# EasyEDA Pro project rpi pico w adapter.epro

# Board PCB1
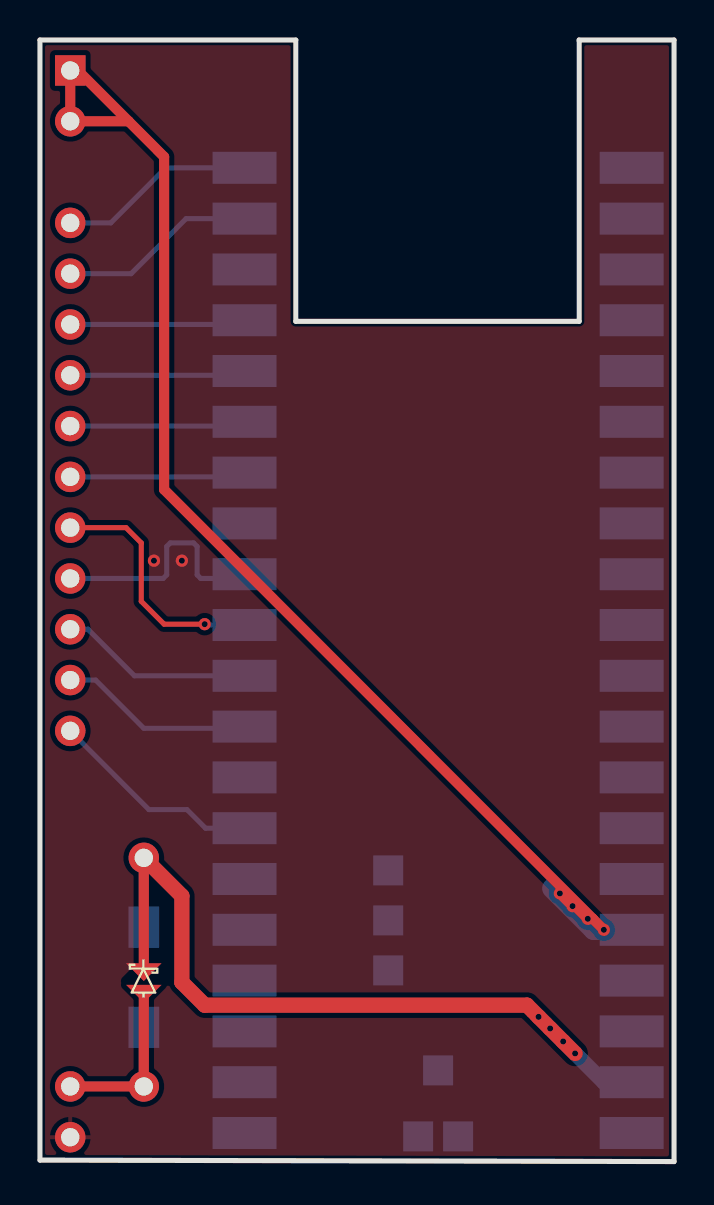
[diagram p0: board, top side]
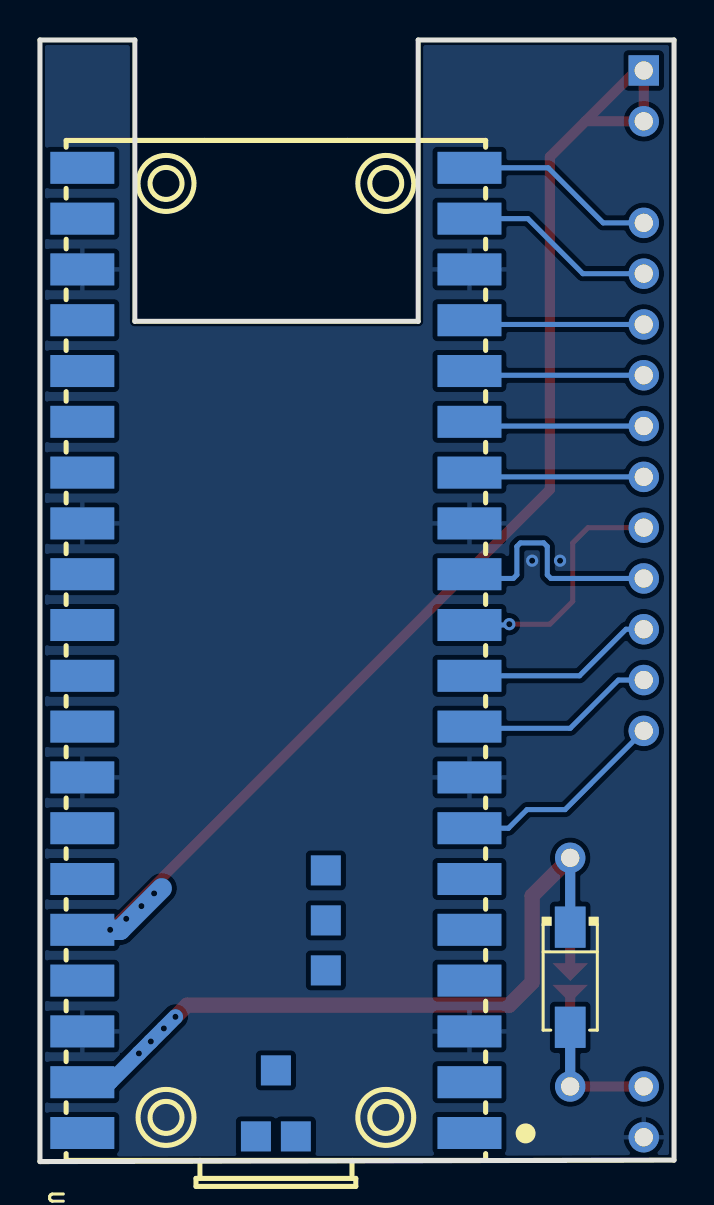
[diagram p1: board, bottom side, seen from below]

Outline 31.74 x 56.08 mm; copper layers: Top Layer, Bottom Layer. Coordinates in mm from the lower left corner of the outline.
Outline path: 0,56.08 0,0.07 31.74,0 31.74,56.08 26.99,56.08 26.99,42.01 12.81,42.01 12.81,56.08 0,56.08
Stack: Top Layer 0.035mm / Dielectric1 1.51mm FR4 er 4.5 / Bottom Layer 0.035mm

## Design rules (mm)
template: JLCPCB Capability(Two Layers Board)
spacing copperThickness1oz (default): track to track 0.102, other pairs 0.152 to 0.3
spacing copperThickness2oz: track to track 0.203, other pairs 0.152 to 0.3
track width copperThickness1oz (default): min 0.127, default 0.254, max 2.54
track width copperThickness2oz: min 0.203, default 0.254, max 2.54
differential pair differentialPair (default): width min 0.127, default 0.254, max 2.54; gap min 0.152, default 0.152
via viaSize (default): diameter min 0.5, default 0.61, max 10; hole min 0.3, default 0.305, max 6.3

## Placement (name value [footprint] x y rotation side)
NOREF  -  [Pad_e25]  1.52 24.08 0 top
NOREF#2  -  [Pad_e24]  1.52 21.54 0 top
NOREF#3  -  [Pad_e33]  1.52 36.78 0 top
NOREF#4  -  [Pad_e23]  1.52 3.76 0 top
NOREF#5  -  [Pad_e38]  1.52 52.02 0 top
NOREF#6  -  [Pad_e26]  1.52 26.62 0 top
NOREF#7  -  [Pad_e120]  5.2 9.47 180 top
NOREF#8  -  [Pad_e32]  1.52 34.24 0 top
NOREF#9  -  [Pad_e118]  5.2 8.39 0 top
NOREF#10  -  [Pad_e27]  1.52 29.16 0 top
NOREF#11  -  [Pad_e34]  1.52 39.32 0 top
NOREF#12  -  [Pad_e41]  5.2 3.76 0 top
NOREF#13  -  [Pad_e36]  1.52 44.4 0 top
NOREF#14  -  [Pad_e37]  1.52 46.94 0 top
NOREF#15  -  [Pad_e39]  1.52 54.56 0 top
NOREF#16  -  [Pad_e40]  5.2 15.19 0 top
NOREF#17  -  [Pad_e28]  1.52 31.7 0 top
NOREF#18  -  [Pad_e22]  1.52 1.22 0 top
NOREF#19  -  [Pad_e35]  1.52 41.86 0 top
schottky  SS54  [SMA_L4.4-W2.8-LS5.4-R-RD]  5.2 9.22 270 bottom
U5  PICO W  [COMM-SMD_L51.0-W21.0-P2.54_PICOW]  19.93 25.47 90 bottom

## Footprints (pads in the part's own frame, mm; a bottom-side part is the same pattern mirrored in y, then rotated)
COMM-SMD_L51.0-W21.0-P2.54_PICOW
  rect 1.6x3.2 smd: 1(-24.045,-9.69) 2(-21.505,-9.69) 3(-18.965,-9.69) 4(-16.425,-9.69) 5(-13.885,-9.69) 6(-11.345,-9.69) 7(-8.805,-9.69) 8(-6.265,-9.69) 9(-3.725,-9.69) 10(-1.185,-9.69) 11(1.355,-9.69) 12(3.895,-9.69) 13(6.435,-9.69) 14(8.975,-9.69) 15(11.515,-9.69) 16(14.055,-9.69) 17(16.595,-9.69) 18(19.135,-9.69) 19(21.675,-9.69) 20(24.215,-9.69) 21(24.215,9.69) 22(21.675,9.69) 23(19.135,9.69) 24(16.595,9.69) 25(14.055,9.69) 26(11.515,9.69) 27(8.975,9.69) 28(6.435,9.69) 29(3.895,9.69) 30(1.355,9.69) 31(-1.185,9.69) 32(-3.725,9.69) 33(-6.265,9.69) 34(-8.805,9.69) 35(-11.345,9.69) 36(-13.885,9.69) 37(-16.425,9.69) 38(-18.965,9.69) 39(-21.505,9.69) 40(-24.045,9.69)
  rect 1.5x1.5 smd: TP1(-20.915,0) TP2(-24.215,1) TP3(-24.215,-1) TP4(-15.915,-2.499) TP5(-13.415,-2.499) TP6(-10.915,-2.499)
Pad_e22
  round 1.524 hole 0.914: 1(0,0)
Pad_e23
  round 1.524 hole 0.914: 1(0,0)
Pad_e24
  round 1.524 hole 0.914: 1(0,0)
Pad_e25
  round 1.524 hole 0.914: 1(0,0)
Pad_e26
  round 1.524 hole 0.914: 1(0,0)
Pad_e27
  round 1.524 hole 0.914: 1(0,0)
Pad_e28
  round 1.524 hole 0.914: 1(0,0)
Pad_e32
  round 1.524 hole 0.914: 1(0,0)
Pad_e33
  round 1.524 hole 0.914: 1(0,0)
Pad_e34
  round 1.524 hole 0.914: 1(0,0)
Pad_e35
  round 1.524 hole 0.914: 1(0,0)
Pad_e36
  round 1.524 hole 0.914: 1(0,0)
Pad_e37
  round 1.524 hole 0.914: 1(0,0)
Pad_e38
  round 1.524 hole 0.914: 1(0,0)
Pad_e39
  rect 1.524x1.524 hole 0.914: 1(0,0)
Pad_e40
  round 1.524 hole 0.914: 1(0,0)
Pad_e41
  round 1.524 hole 0.914: 2(0,0)
Pad_e118
  custom 1.778x0.889 smd: 3(0,0)
Pad_e120
  custom 1.778x0.889 smd: 3(0,0)
SMA_L4.4-W2.8-LS5.4-R-RD
  rect 2.062x1.539 smd: 1(2.503,0) 2(-2.503,0)

## Nets
+3V3: NOREF#5.1 NOREF#15.1 U5.36
+5V: NOREF#4.1 NOREF#9.3 NOREF#12.2 schottky.1
GND: NOREF#18.1 U5.3 U5.8 U5.13 U5.18 U5.23 U5.28 U5.33 U5.38
/AUX-CONNECTORS/AYAB_SCL: NOREF#10.1 U5.12
/AUX-CONNECTORS/AYAB_SDA: NOREF#17.1 U5.11
/ESP32/ENC_A: NOREF.1 U5.9
/ESP32/ENC_B: NOREF#2.1 U5.7
/ESP32/ENC_BP: NOREF#6.1 U5.10
/ESP32/EOL_L_N: NOREF#19.1 U5.17
/ESP32/EOL_L_P: NOREF#11.1 U5.16
/ESP32/EOL_R_N: NOREF#14.1 U5.20
/ESP32/EOL_R_P: NOREF#13.1 U5.19
BUZZER: NOREF#8.1 U5.14
SPARE: NOREF#3.1 U5.15
VSYS: NOREF#7.3 NOREF#16.1 schottky.2 U5.39

Pads without a net: U5 1 2 4 5 6 21 22 24 25 26 27 29 30 31 32 34 35 37 40 TP1 TP2 TP3 TP4 TP5 TP6

## Via types
v1: diameter 0.61, hole 0.305, Top Layer to Bottom Layer, 11 vias

## Routing (per net, layer and track width the routed paths; a pad name or vN(x,y) marks a point on that pad's centre or on a via; arc(x,y) is an arc through that point)
+3V3: length 66.7
  Top Layer w0.508: 4.44,52.02 NOREF#5.1 NOREF#15.1 1.9,54.56 4.44,52.02 ; 4.44,52.02 6.22,50.24 6.22,33.6 27.68,12.14 ; v1(26.03,13.41) v1(26.66,12.77) 26.79,12.77 v1(27.42,12.14) 27.68,12.14 ; v1(28.23,11.59) 27.68,12.14
  Bottom Layer w1.016: 25.65,13.66 27.72,11.59 v1(28.23,11.59) U5.36
+5V: length 11.3
  Top Layer w0.508: NOREF#9.3 NOREF#12.2 NOREF#4.1
  Bottom Layer w0.508: NOREF#12.2 schottky.1
GND:
  vias: v1(5.71,30.05) v1(7.1,30.05)
/AUX-CONNECTORS/AYAB_SCL: length 11.9
  Bottom Layer w0.254: U5.12 10.03,29.16 8.05,29.16 7.87,29.34 7.87,30.76 7.69,30.94 6.52,30.94 6.34,30.76 6.34,29.34 6.17,29.16 NOREF#10.1
/AUX-CONNECTORS/AYAB_SDA: length 12.5
  Top Layer w0.254: v1(8.25,26.87) 6.22,26.87 5.07,28.01 5.07,30.94 4.31,31.7 NOREF#17.1
  Bottom Layer w0.254: v1(8.25,26.87) 8.29,26.83 U5.11
/ESP32/ENC_A: length 9.8
  Bottom Layer w0.254: NOREF.1 2.79,24.08 5.2,21.66 10.16,21.66 U5.9
/ESP32/ENC_B: length 10.7
  Bottom Layer w0.254: U5.7 8.29,16.67 7.36,17.6 5.45,17.6 NOREF#2.1
/ESP32/ENC_BP: length 9.7
  Bottom Layer w0.254: NOREF#6.1 2.41,26.62 4.73,24.29 U5.10
/ESP32/EOL_L_N: length 8.8
  Bottom Layer w0.254: NOREF#19.1 10.03,41.86 U5.17
/ESP32/EOL_L_P: length 8.8
  Bottom Layer w0.254: NOREF#11.1 10.03,39.32 U5.16
/ESP32/EOL_R_N: length 9.9
  Bottom Layer w0.254: U5.20 6.3,49.69 3.55,46.94 NOREF#14.1
/ESP32/EOL_R_P: length 9.9
  Bottom Layer w0.254: NOREF#13.1 4.56,44.4 7.32,47.15 U5.19
BUZZER: length 8.8
  Bottom Layer w0.254: NOREF#8.1 10.03,34.24 U5.14
SPARE: length 8.8
  Bottom Layer w0.254: U5.15 10.03,36.78 NOREF#3.1
VSYS: length 43.4
  Top Layer w0.508: NOREF#7.3 NOREF#16.1
  Top Layer w0.762: v1(26.79,5.41) v1(26.19,6.01) v1(25.54,6.66) v1(24.96,7.24) 24.38,7.82 8.25,7.82 7.1,8.96 7.1,13.28 NOREF#16.1
  Bottom Layer w0.508: schottky.2 NOREF#16.1
  Bottom Layer w0.762: U5.39 28.23,3.97 v1(26.79,5.41) v1(26.19,6.01) v1(25.54,6.66) v1(24.96,7.24)

## Copper pours and planes (outline as drawn; the poured copper is in the pictures)
GND on Top Layer: -57.03,71.45 52.57,71.45 52.57,-12.63 -57.03,-12.63
GND on Bottom Layer: -61.48,67.89 43.3,67.89 43.3,-10.21 -61.48,-10.21
GND on Bottom Layer: -45.86,58.49 36.69,58.49 36.69,-1.7 -45.86,-1.7
